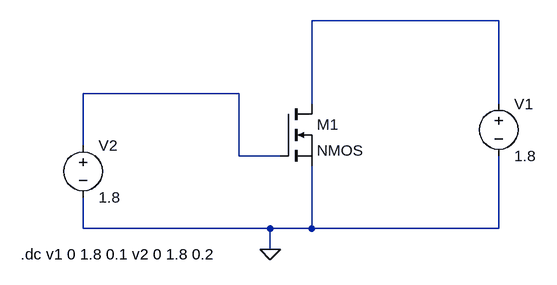
[diagram p0: schematic mosfet.asc]
mosfet.asc, the LTspice schematic file:
Version 4.1
SHEET 1 880 680
WIRE 512 0 224 0
WIRE 112 112 -128 112
WIRE 224 128 224 0
WIRE 512 128 512 0
WIRE -128 192 -128 112
WIRE 112 208 112 112
WIRE 176 208 112 208
WIRE -128 320 -128 272
WIRE 160 320 -128 320
WIRE 224 320 224 224
WIRE 224 320 160 320
WIRE 512 320 512 208
WIRE 512 320 224 320
WIRE 160 352 160 320
FLAG 160 352 0
SYMBOL nmos 176 128 R0
SYMATTR InstName M1
SYMBOL voltage 512 112 R0
WINDOW 123 0 0 Left 0
WINDOW 39 0 0 Left 0
SYMATTR InstName V1
SYMATTR Value 1.8
SYMBOL voltage -128 176 R0
WINDOW 123 0 0 Left 0
WINDOW 39 0 0 Left 0
SYMATTR InstName V2
SYMATTR Value 1.8
TEXT -224 360 Left 2 !.dc v1 0 1.8 0.1 v2 0 1.8 0.2

The netlist it stands for:
* mosfet.asc
M1 N001 N002 0 0 NMOS
V1 N001 0 1.8
V2 N002 0 1.8
.model NMOS NMOS
.model PMOS PMOS
.lib standard.mos
.dc v1 0 1.8 0.1 v2 0 1.8 0.2
.backanno
.end